# Altium schematic sheet Sheet1.SchDoc
size A4; SheetNumber: 1; SheetTotal: 1
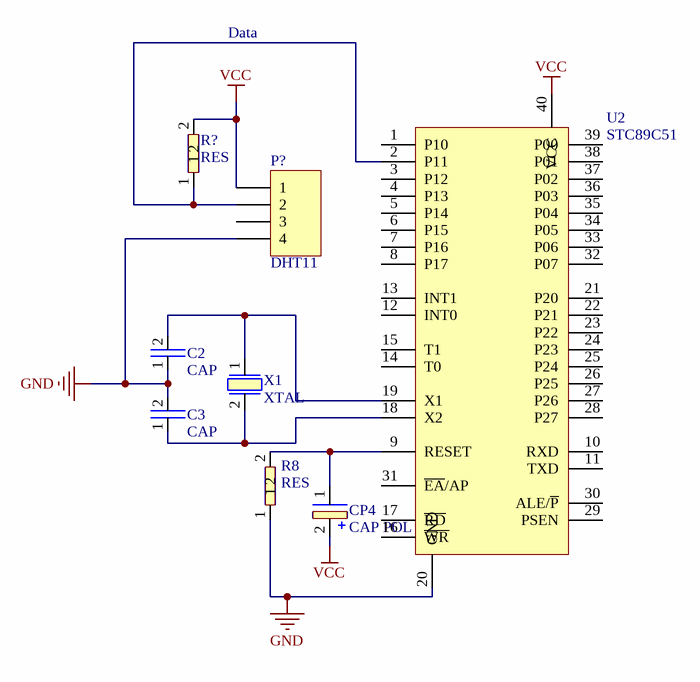
[diagram p0: Sheet1.SchDoc]

## Parts
C2  CAP  [CAP]
C3  CAP  [CAP]
CP4  CAP POL  [CAP POL]
P?  DHT11  [HDR1X4]
R8  RES  [RES]
R?  RES  [RES]
U2  STC89C51  [STC89C51]
X1  XTAL  [XTAL]

## Nets
GND: C2.1 C3.2 P?.4 R8.1 U2.20(GND)
VCC: CP4.2 P?.1 R?.2 U2.40(VCC)
NetC2_2: C2.2 U2.19(X1) X1.1
NetC3_1: C3.1 U2.18(X2) X1.2
NetCP4_1: CP4.1 R8.2 U2.9(RESET)
NetP?_2: P?.2 R?.1 U2.2(P11)

Not connected (* = marked no-connect by the designer): P? 3; U2 1(P10) 3(P12) 4(P13) 5(P14) 6(P15) 7(P16) 8(P17) 10(RXD) 11(TXD) 12(INT0) 13(INT1) 14(T0) 15(T1) 16(~{WR}) 17(~{RD}) 21(P20) 22(P21) 23(P22) 24(P23) 25(P24) 26(P25) 27(P26) 28(P27) 29(PSEN) 30(ALE/~{P}) 31(~{EA}/AP) 32(P07) 33(P06) 34(P05) 35(P04) 36(P03) 37(P02) 38(P01) 39(P00)

## Notes on the sheet
- Data

## Library data of the parts
P? = Header 4: Header, 4-Pin; LatestRevisionDate: 17-Jul-2002; LatestRevisionNote: Re-released for DXP Platform.; Publisher: Altium Limited